# Altium schematic sheet top.SchDoc
size 381 x 241 mm; SheetNumber: 1; SheetTotal: 2; SPICEModelCacheGEPUECLQ: <root> / <DocumentId>GEPUECLQ</DocumentId> / </root>
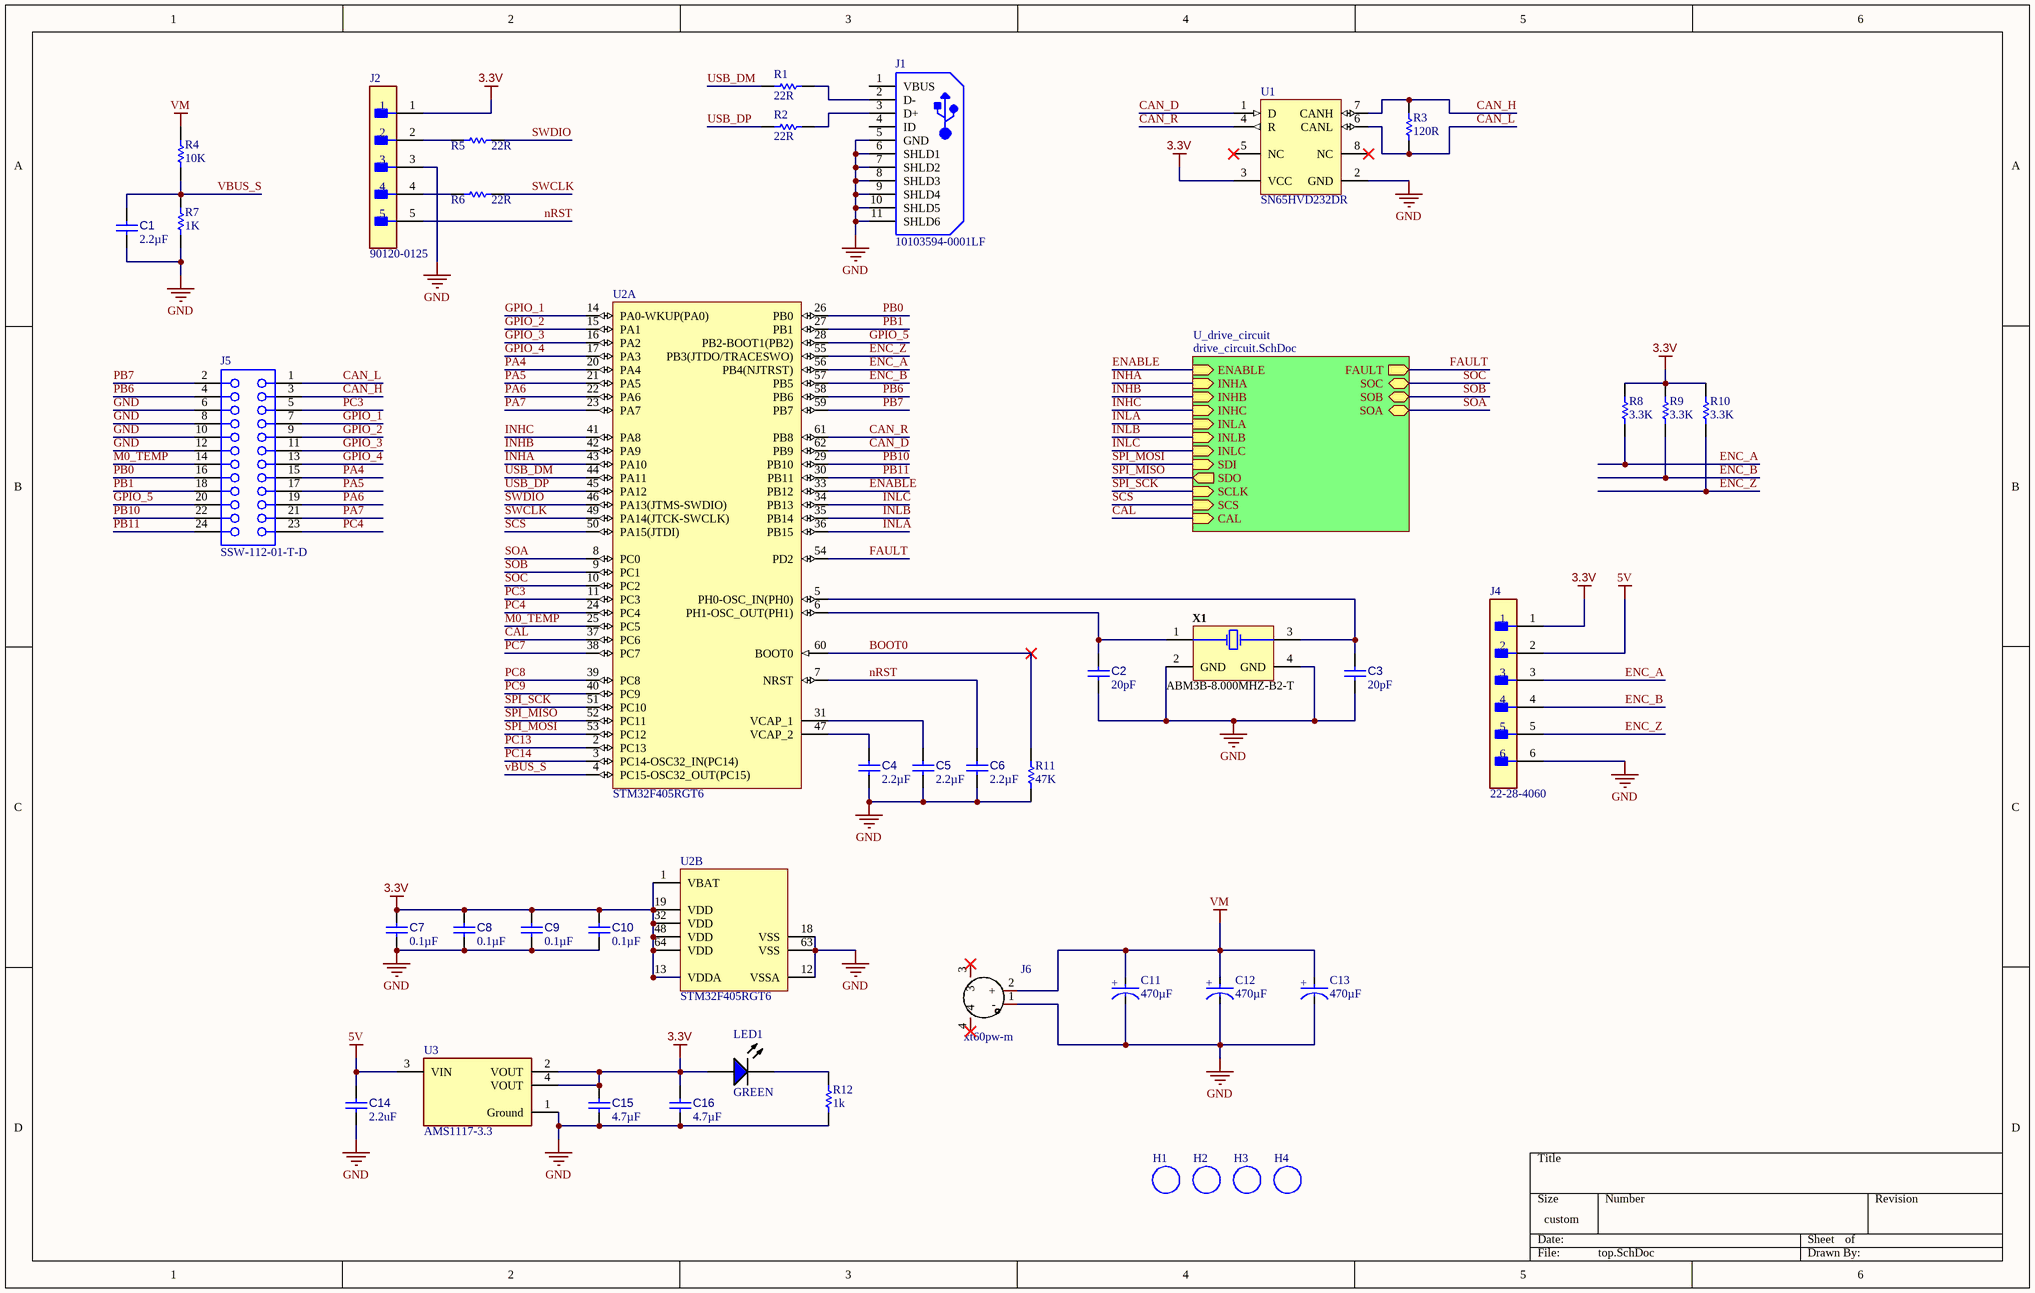
[diagram p0: top.SchDoc]

## Parts
C1  value 2.2µF  [CAPC0603(1608)100_L]  (hidden comment: Capacitor 4.7µF +/-20% 10V 0603)
C2  value 20pF  [CAPC0603(1608)100_L]  (hidden comment: Capacitor 4.7µF +/-20% 10V 0603)
C3  value 20pF  [CAPC0603(1608)100_L]  (hidden comment: Capacitor 4.7µF +/-20% 10V 0603)
C4  value 2.2µF  [CAPC0603(1608)100_L]  (hidden comment: Capacitor 4.7µF +/-20% 10V 0603)
C5  value 2.2µF  [CAPC0603(1608)100_L]  (hidden comment: Capacitor 4.7µF +/-20% 10V 0603)
C6  value 2.2µF  [CAPC0603(1608)100_L]  (hidden comment: Capacitor 4.7µF +/-20% 10V 0603)
C7  value 0.1µF  [CAPC0603(1608)100_L]  (hidden comment: Capacitor 4.7µF +/-20% 10V 0603)
C8  value 0.1µF  [CAPC0603(1608)100_L]  (hidden comment: Capacitor 4.7µF +/-20% 10V 0603)
C9  value 0.1µF  [CAPC0603(1608)100_L]  (hidden comment: Capacitor 4.7µF +/-20% 10V 0603)
C10  value 0.1µF  [CAPC0603(1608)100_L]  (hidden comment: Capacitor 4.7µF +/-20% 10V 0603)
C11  value 470µF  [FP-FPG-MFG]  (hidden comment: EEE-FP1E471AP)
C12  value 470µF  [FP-FPG-MFG]  (hidden comment: EEE-FP1E471AP)
C13  value 470µF  [FP-FPG-MFG]  (hidden comment: EEE-FP1E471AP)
C14  value 2.2uF  [CAPC0603(1608)100_L]  (hidden comment: Capacitor 4.7µF +/-20% 10V 0603)
C15  value 4.7µF  [CAPC0603(1608)100_L]  (hidden comment: Capacitor 4.7µF +/-20% 10V 0603)
C16  value 4.7µF  [CAPC0603(1608)100_L]  (hidden comment: Capacitor 4.7µF +/-20% 10V 0603)
H1  (no value)  [M3 Hole]
H2  (no value)  [M3 Hole]
H3  (no value)  [M3 Hole]
H4  (no value)  [M3 Hole]
J1  10103594-0001LF  [FCI-10103594-0001LF_V]
J2  90120-0125  [FP-90120-0125-MFG]
J4  22-28-4060  [FP-22-28-4060-MFG]
J5  SSW-112-01-T-D  [SMTC-SSW-112-01-X-D]
J6  xt60pw-m  [CONN-TH_XT60PW-M]
LED1  GREEN  [VISH-TLMX1100-2_V]
R1  value 22R  [RESC1608X55X25ML10T15]  (hidden comment: Resistor 0R +/- 5% 0603 100 mW)
R2  value 22R  [RESC1608X55X25ML10T15]  (hidden comment: Resistor 0R +/- 5% 0603 100 mW)
R3  value 120R  [RESC1608X55X25ML10T15]  (hidden comment: Resistor 0R +/- 5% 0603 100 mW)
R4  value 10K  [RESC1608X55X25ML10T15]  (hidden comment: Resistor 0R +/- 5% 0603 100 mW)
R5  value 22R  [RESC1608X55X25ML10T15]  (hidden comment: Resistor 0R +/- 5% 0603 100 mW)
R6  value 22R  [RESC1608X55X25ML10T15]  (hidden comment: Resistor 0R +/- 5% 0603 100 mW)
R7  value 1K  [RESC1608X55X25ML10T15]  (hidden comment: Resistor 0R +/- 5% 0603 100 mW)
R8  value 3.3K  [RESC1608X55X25ML10T15]  (hidden comment: Resistor 0R +/- 5% 0603 100 mW)
R9  value 3.3K  [RESC1608X55X25ML10T15]  (hidden comment: Resistor 0R +/- 5% 0603 100 mW)
R10  value 3.3K  [RESC1608X55X25ML10T15]  (hidden comment: Resistor 0R +/- 5% 0603 100 mW)
R11  value 47K  [RESC1608X55X25ML10T15]  (hidden comment: Resistor 0R +/- 5% 0603 100 mW)
R12  value 1k  [RESC1608X55X25ML10T15]  (hidden comment: Resistor 0R +/- 5% 0603 100 mW)
U1  SN65HVD232DR  [D0008A_L]
U2  STM32F405RGT6  [STM-LQFP64_M]  (parts A,B of 2)
U3  AMS1117-3.3  [FP-AMS1117-IPC_B]
X1  ABM3B-8.000MHZ-B2-T  [ABRA-ABM3B_V]

## Sub-sheets
U_drive_circuit = drive_circuit.SchDoc: ENABLE (in), INHA (in), INHB (in), INHC (in), FAULT (out), INLA (in), INLB (in), INLC (in), SDI (in), SDO (out), SCLK (in), SCS (in), CAL (in), SOC (bidir), SOB (bidir), SOA (bidir)

## Nets
3.3V: C7.2 C8.2 C9.2 C10.2 C15.2 C16.2 J2.1 J4.1 LED1.1(A) R8.1 R9.1 R10.1 U1.3(VCC) U2.1(VBAT) U2.13(VDDA) U2.19(VDD) U2.32(VDD) U2.48(VDD) U2.64(VDD) U3.2(VOUT) U3.4(VOUT)
5V: C14.2 J4.2 U3.3(VIN)
GND: C1.1 C2.1 C3.1 C4.1 C5.1 C6.1 C7.1 C8.1 C9.1 C10.1 C11.1(C) C12.1(C) C13.1(C) C14.1 C15.1 C16.1 J1.5(GND) J1.6(SHLD1) J1.7(SHLD2) J1.8(SHLD3) J1.9(SHLD4) J1.10(SHLD5) J1.11(SHLD6) J2.3 J4.6 J5.6 J5.8 J5.10 J5.12 J6.1(-) R7.2 R11.2 R12.1 U1.2(GND) U2.12(VSSA) U2.18(VSS) U2.63(VSS) U3.1(Ground) X1.2(GND) X1.4(GND)
VM: C11.2(A) C12.2(A) C13.2(A) J6.2(+) R4.1
BOOT0: R11.1 U2.60(BOOT0)
CAL: U2.37(PC6) ; sheet U_drive_circuit/CAL
CAN_D: U1.1(D) U2.62(PB9)
CAN_H: J5.3 R3.2 U1.7(CANH)
CAN_L: J5.1 R3.1 U1.6(CANL)
CAN_R: U1.4(R) U2.61(PB8)
ENABLE: U2.33(PB12) ; sheet U_drive_circuit/ENABLE
ENC_A: J4.3 R8.2 U2.56(PB4(NJTRST))
ENC_B: J4.4 R9.2 U2.57(PB5)
ENC_Z: J4.5 R10.2 U2.55(PB3(JTDO/TRACESWO))
FAULT: U2.54(PD2) ; sheet U_drive_circuit/FAULT
GPIO_1: J5.7 U2.14(PA0-WKUP(PA0))
GPIO_2: J5.9 U2.15(PA1)
GPIO_3: J5.11 U2.16(PA2)
GPIO_4: J5.13 U2.17(PA3)
GPIO_5: J5.20 U2.28(PB2-BOOT1(PB2))
INHA: U2.43(PA10) ; sheet U_drive_circuit/INHA
INHB: U2.42(PA9) ; sheet U_drive_circuit/INHB
INHC: U2.41(PA8) ; sheet U_drive_circuit/INHC
INLA: U2.36(PB15) ; sheet U_drive_circuit/INLA
INLB: U2.35(PB14) ; sheet U_drive_circuit/INLB
INLC: U2.34(PB13) ; sheet U_drive_circuit/INLC
M0_TEMP: J5.14 U2.25(PC5)
nRST: C6.2 J2.5 U2.7(NRST)
PA4: J5.15 U2.20(PA4)
PA5: J5.17 U2.21(PA5)
PA6: J5.19 U2.22(PA6)
PA7: J5.21 U2.23(PA7)
PB0: J5.16 U2.26(PB0)
PB1: J5.18 U2.27(PB1)
PB6: J5.4 U2.58(PB6)
PB7: J5.2 U2.59(PB7)
PB10: J5.22 U2.29(PB10)
PB11: J5.24 U2.30(PB11)
PC3: J5.5 U2.11(PC3)
PC4: J5.23 U2.24(PC4)
PC7: U2.38(PC7)
PC8: U2.39(PC8)
PC9: U2.40(PC9)
PC13: U2.2(PC13)
PC14: U2.3(PC14-OSC32_IN(PC14))
SCS: U2.50(PA15(JTDI)) ; sheet U_drive_circuit/SCS
SOA: U2.8(PC0) ; sheet U_drive_circuit/SOA
SOB: U2.9(PC1) ; sheet U_drive_circuit/SOB
SOC: U2.10(PC2) ; sheet U_drive_circuit/SOC
SPI_MISO: U2.52(PC11) ; sheet U_drive_circuit/SDO
SPI_MOSI: U2.53(PC12) ; sheet U_drive_circuit/SDI
SPI_SCK: U2.51(PC10) ; sheet U_drive_circuit/SCLK
SWCLK: R6.1 U2.49(PA14(JTCK-SWCLK))
SWDIO: R5.1 U2.46(PA13(JTMS-SWDIO))
USB_DM: R1.2 U2.44(PA11)
USB_DP: R2.2 U2.45(PA12)
vBUS_S: C1.2 R4.2 R7.1 U2.4(PC15-OSC32_OUT(PC15))
NetC2_2: C2.2 U2.6(PH1-OSC_OUT(PH1)) X1.1(X1)
NetC3_2: C3.2 U2.5(PH0-OSC_IN(PH0)) X1.3(X2)
NetC4_2: C4.2 U2.47(VCAP_2)
NetC5_2: C5.2 U2.31(VCAP_1)
NetJ1_2: J1.2(D-) R1.1
NetJ1_3: J1.3(D+) R2.1
NetJ2_2: J2.2 R5.2
NetJ2_4: J2.4 R6.2
NetLED1_2: LED1.2(K) R12.2

Not connected (* = marked no-connect by the designer): J1 1(VBUS) 4(ID); J6 3* 4*; U1 5(NC)* 8(NC)*

## Notes on the sheet
- (in symbol CMP-001-00087-1) +

## Library data of the parts
C1-C10 C14-C16 = CMP-001-00076-4: Chip Capacitor, 4.7µF +/-20%, 10V, 0603, Thickness 1 mm; Tolerance: 10%; Mounting Technology: SMT; Case/Package: 0603; Pins: 2; Min Operating Temperature: -55°C; Max Operating Temperature: 85°C; Voltage Rating: 10V
C11-C13 = CMP-001-00087-1: Aluminum Electrolytic Capacitor, 470 uF, 25 V, ± 20%, 2000 hours @ 105°C, Radial Can - SMD; Voltage Rating: 25V; Ripple Current (AC): 1.19A; Case/Package: Radial; Tolerance: 20%; Min Operating Temperature: -55°C; Mounting Technology: Surface Mount,PCB; RoHS Compliant: Yes; Pins: 2; Max Operating Temperature: 105°C; Ripple Current: 1.19A
H1-H4 = M3 Hole: M3 Hole with no copper
J1 = CMP-015-00009-1: Conn Micro USB 2.0 Type B RCP 5 POS 0.65mm Solder RA SMD 5 Terminal 1 Port T/R; Mounting Technology: Surface Mount,Horizontal; Pins: 5; Max Operating Temperature: 85°C; Min Operating Temperature: -55°C
J2 = CMP-015-00010-1: 2.54mm Pitch C-Grid III Header, Single Row, Vertical, 5 Circuits, Tin (Sn) Plating; Min Operating Temperature: -55°C; RoHS Compliant: Yes; Max Operating Temperature: 125°C; Mounting Technology: Through Hole
J4 = CMP-015-00011-1: KK 254 Breakaway Header, Vertical, 6 Circuits, Tin (Sn) Plating, Mating Pin Length 6.09mm; Mounting Technology: Through Hole; Max Operating Temperature: 75°C; Min Operating Temperature: 0°C; RoHS Compliant: Yes
J5 = CMP-002-00072-1: Board Connector, 24 Contact(s), 2 Row(s), Female, Straight, 0.1 inch Pitch, Solder Terminal, Locking, Socket; Connector Type: BOARD CONNECTOR; RoHS Compliant: Yes; Mounting Technology: Board
LED1 = CMP-007-00028-2: red LED, 10 mA, 2 V, -40 to 100 degC, 2-Pin SMD (0603), RoHS, Tape and Reel; Manufacturer: Vishay Semiconductor; Forward Voltage: 3.9V; Illumination Colour: Blue; Viewing Angle: 160degrees; Power: 68mW; Forward Current: 10mA; Lens Style: Diffused; Luminous Intensity: 5mcd; Case/Package: 0603; Datasheet URL: http://download.siliconexpert.com/pdfs/2016/8/7/12/43/26/667/vsh_/manual/379263299541529tlmb1100.pdf; Datasheet Version: Rev. 2.7, 03/2016; Manufacturer URL: http://www.vishay.com/; Package Reference: 0603; Min Operating Temperature: -40°C; Packaging: TapeandReel; RoHS Compliant: True; Nominal Vf: 3.9V; Mounting Technology: SM; Pins: 2; Package Description: 2-Pin Surface Mount Device, Body 1.6 x 0.8 mm; Colour: Blue; Package Quantity: 3000; Max Operating Temperature: 100°C
R1 R2 R4-R11 = CMP-009-00006-5: Chip Resistor, 22 Ohm, 0.1 W, -55 to 155 degC, 0603 (1608 Metric); Power: 100mW; Voltage Rating: 50V; Max Operating Temperature: 155°C; RoHS Compliant: True; Mounting Technology: SM; Case/Package: 0603; Min Operating Temperature: -55°C; Tolerance: 5%; Pins: 2
R3 = CMP-009-00006-5: Chip Resistor, 120 Ohm, 0.1 W, -55 to 155 degC, 0603 (1608 Metric); Power: 100mW; Voltage Rating: 50V; Max Operating Temperature: 155°C; RoHS Compliant: True; Mounting Technology: SM; Case/Package: 0603; Min Operating Temperature: -55°C; Tolerance: 5%; Pins: 2
R12 = CMP-009-00006-5: Chip Resistor, 1K Ohm, 0.1 W, -55 to 155 degC, 0603 (1608 Metric); Power: 100mW; Voltage Rating: 50V; Max Operating Temperature: 155°C; RoHS Compliant: True; Mounting Technology: SM; Case/Package: 0603; Min Operating Temperature: -55°C; Tolerance: 5%; Pins: 2
U1 = CMP-015-00008-1: EAR99 65HVD232 Tape & Reel (TR) CANbus interface receiver 100mV 17mA 72.603129mg 1Mbps; Max Supply Voltage: 3.6V; Min Supply Voltage: 3V; Max Operating Temperature: 85°C; Min Operating Temperature: -40°C; Pins: 8; RoHS Compliant: Yes; Case/Package: D
U2 = CMP-020-00025-1: MCU 32-bit STM32F ARM Cortex M4F RISC 1024KB Flash 2.5V/3.3V 64-Pin LQFP Tray; Number of SPI Channels: 3; Number of Channels: 16; Interface: I2C,SPI,USB,CAN,IrDA,UART,USART,LIN,I2S; Oscillator Type: Internal; Watchdog Timer: Yes; Number of Timers/Counters: 14; Number of I/Os: 51; Number of UART Channels: 2; RAM Size: 196KB; Nominal Supply Current: 1.7uA; Data Bus Width: 32b; Max Supply Voltage: 3.6V; Clock Frequency: 168MHz; Min Supply Voltage: 1.8V; Peripherals: Brown-out Detect/Reset,POR,PWM,WDT,DMA,LCD,I2C; Length: 10mm; Memory Size: 1024KB; Lead Free: Lead Free; Height: 1.45mm; Case/Package: LQFP; Min Operating Temperature: -40°C; Series: STM32 F4; Package Quantity: 960; Number of PWM Channels: 2; Max Operating Temperature: 85°C; Core Architecture: ARM; Packaging: Tray; Number of ADC Channels: 16; Pins: 64; Radiation Hardening: No; Number of Programmable I/O: 51; Memory Format: FLASH; Number of USB Channels: 2; Reach SVHC Compliant: No; RoHS Compliant: Yes; Width: 10mm; Number of D/A Converters: 2; Number of A/D Converters: 3; Number of I2C Channels: 3; Frequency: 168MHz
U3 = CMP-019-00049-1: Fixed Positive LDO Regulator, 3.3V, 1.3V Dropout, PDSO3; Pins: 3; RoHS Compliant: Yes; Case/Package: SOP
X1 = CMP-003-00021-2: Ceramic SMD Crystal, 8 MHz, +/- 20 ppm, 18 pF, -20 to 70 degC, 4-Pin SMD, RoHS, Tape and Reel; Manufacturer: Abracon; Resistance: 200Ohm; ESR: 200; Tolerance: 20ppm; Frequency: 8MHz; Load Capacitance: 18pF; Mounting Technology: SM; Case/Package: CSMD; Pins: 4; Datasheet Version: Aug-15; Datasheet URL: http://www.abracon.com/Resonators/abm3b.pdf; Manufacturer URL: http://www.abracon.com/; Package Quantity: 1000; Package Description: 4-Pin Surface Mount Device, Body 5 x 3.2 mm; Package Reference: ABM3B; Min Operating Temperature: -20°C; Max Operating Temperature: 70°C; Packaging: TapeandReel; Frequency Tolerance: 20ppm; RoHS Compliant: True